# EAGLE schematic har_DAA_CS (EAGLE 7.6.0)
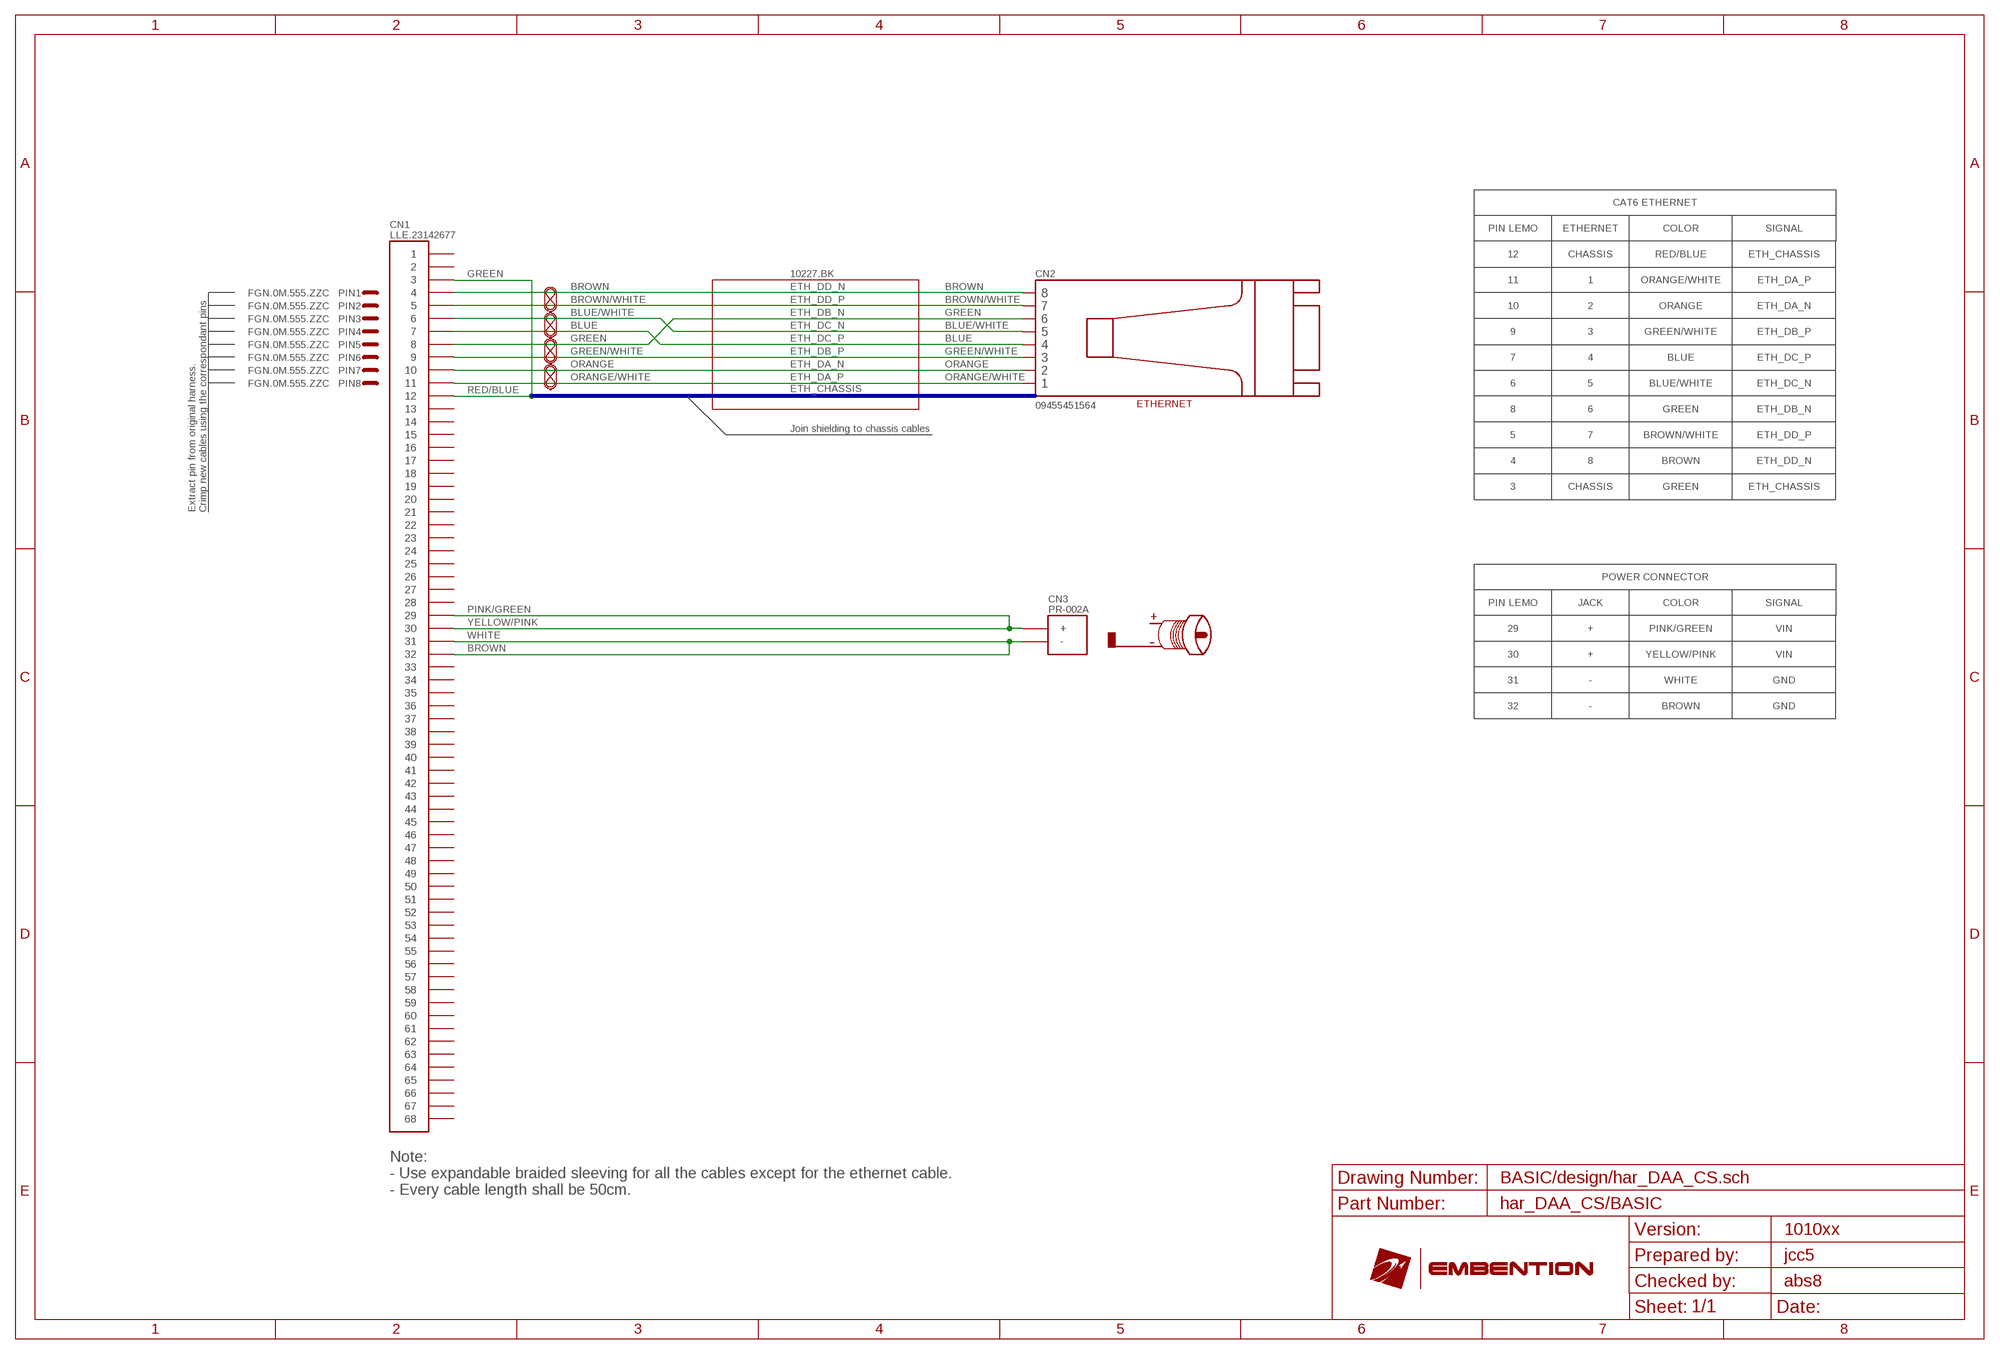
[diagram p0: schematic, sheet 1]

## Parts
CN1  LLE.23142677  68-PIN-NUM  [68-PIN]
CN2  09455451564  ETHERNET_FEMALE_CONN  [11PIN]
CN3  PR-002A  2-PIN-POS-NEG  [2-PIN]
PIN1  FGN.0M.555.ZZC  CONN-PIN  [1-PIN]
PIN2  FGN.0M.555.ZZC  CONN-PIN  [1-PIN]
PIN3  FGN.0M.555.ZZC  CONN-PIN  [1-PIN]
PIN4  FGN.0M.555.ZZC  CONN-PIN  [1-PIN]
PIN5  FGN.0M.555.ZZC  CONN-PIN  [1-PIN]
PIN6  FGN.0M.555.ZZC  CONN-PIN  [1-PIN]
PIN7  FGN.0M.555.ZZC  CONN-PIN  [1-PIN]
PIN8  FGN.0M.555.ZZC  CONN-PIN  [1-PIN]
U1  2PINMALLA  [100P]
U2  2PINMALLA  [100P]
U3  2PINMALLA  [100P]
U4  2PINMALLA  [100P]
WIRE1  10227.BK  WIRE  [WIRE]

## Nets
ETH_CHASSIS: CN1.P$3 CN1.P$12
ETH_DA_N: CN1.P$10 CN2.2
ETH_DA_P: CN1.P$11 CN2.1
ETH_DB_N: CN1.P$8 CN2.6
ETH_DB_P: CN1.P$9 CN2.3
ETH_DC_N: CN1.P$6 CN2.5
ETH_DC_P: CN1.P$7 CN2.4
ETH_DD_N: CN1.P$4 CN2.8
ETH_DD_P: CN1.P$5 CN2.7
GND: CN1.P$31 CN1.P$32 CN3.P$2(-)
VIN: CN1.P$29 CN1.P$30 CN3.P$1(+)
Unconnected: CN1.P$1 CN1.P$2 CN1.P$13 CN1.P$14 CN1.P$15 CN1.P$16 CN1.P$17 CN1.P$18 CN1.P$19 CN1.P$20 CN1.P$21 CN1.P$22 CN1.P$23 CN1.P$24 CN1.P$25 CN1.P$26 CN1.P$27 CN1.P$28 CN1.P$33 CN1.P$34 CN1.P$35 CN1.P$36 CN1.P$37 CN1.P$38 CN1.P$39 CN1.P$40 CN1.P$41 CN1.P$42 CN1.P$43 CN1.P$44 CN1.P$45 CN1.P$46 CN1.P$47 CN1.P$48 CN1.P$49 CN1.P$50 CN1.P$51 CN1.P$52 CN1.P$53 CN1.P$54 CN1.P$55 CN1.P$56 CN1.P$57 CN1.P$58 CN1.P$59 CN1.P$60 CN1.P$61 CN1.P$62 CN1.P$63 CN1.P$64 CN1.P$65 CN1.P$66 CN1.P$67 CN1.P$68 PIN1.P$1 PIN2.P$1 PIN3.P$1 PIN4.P$1 PIN5.P$1 PIN6.P$1 PIN7.P$1 PIN8.P$1

## Buses
ETH_CHASSIS

## Notes on the sheet
- CAT6 ETHERNET
- PIN LEMO | ETHERNET | COLOR | SIGNAL
- 12 | CHASSIS | RED/BLUE | ETH_CHASSIS
- GREEN | 11 | 1 | ORANGE/WHITE | ETH_DA_P
- BROWN | BROWN
- BROWN/WHITE | BROWN/WHITE | 10 | 2 | ORANGE | ETH_DA_N
- BLUE/WHITE | GREEN
- BLUE | BLUE/WHITE | 9 | 3 | GREEN/WHITE | ETH_DB_P
- GREEN | BLUE
- GREEN/WHITE | GREEN/WHITE | 7 | 4 | BLUE | ETH_DC_P
- ORANGE | ORANGE
- ORANGE/WHITE | ORANGE/WHITE | 6 | 5 | BLUE/WHITE | ETH_DC_N
- RED/BLUE
- ETHERNET
- 8 | 6 | GREEN | ETH_DB_N
- Join shielding to chassis cables | 5 | 7 | BROWN/WHITE | ETH_DD_P
- 4 | 8 | BROWN | ETH_DD_N
- 3 | CHASSIS | GREEN | ETH_CHASSIS
- Extract pin from original harness. 
  Crimp new cables using the correspondant pins
- POWER CONNECTOR
- PIN LEMO | JACK | COLOR | SIGNAL
- PINK/GREEN
- +
- YELLOW/PINK | 29 | + | PINK/GREEN | VIN
- WHITE
- -
- BROWN | 30 | + | YELLOW/PINK | VIN
- 31 | - | WHITE | GND
- 32 | - | BROWN | GND
- BASIC/design/har_DAA_CS.sch
- Note: 
  - Use expandable braided sleeving for all the cables except for the ethernet cable.
  - Every cable length shall be 50cm.
- har_DAA_CS/BASIC
- 1010xx
- jcc5
- abs8

## Library data of the parts
CN1 = emb-har-Connectors:68-PIN-NUM; PNS: HAR-CONN-LLE.23142677.pns
CN2 = Visual:ETHERNET_FEMALE_CONN; PNS: HAR-CONN-09455451564.pns
CN3 = emb-har-Connectors:2-PIN-POS-NEG; PNS: HAR-CONN-PR-002A.pns
PIN1-PIN8 = emb-har-Electrical_Terminations:CONN-PIN; PNS: HAR-TERM-FGN.0M.555.ZZC.pns
U1-U4 = Visual:2PINMALLA
WIRE1 = emb-har-Cables:WIRE; PNS: HAR-WIRE-10227.BK.pns

## Net classes
4 100R: width 0.102 mm, clearance 0.102 mm